# Altium schematic sheet PL_DDR.SchDoc: PL_DDR
size A2; Author: Carlos Barreiro; Organization: Escuela Técnica Superior de Ingeniería de Sistemas Informáticos de la Universidad Politécnica de Madrid; Address1: Campus Sur de la Universidad Politécnica de Madrid; Address2: Calle de Alan Turing, s/nº; Address3: Madrid 28031; Address4: España; DocumentNumber: 4; SheetNumber: 4; SheetTotal: 16
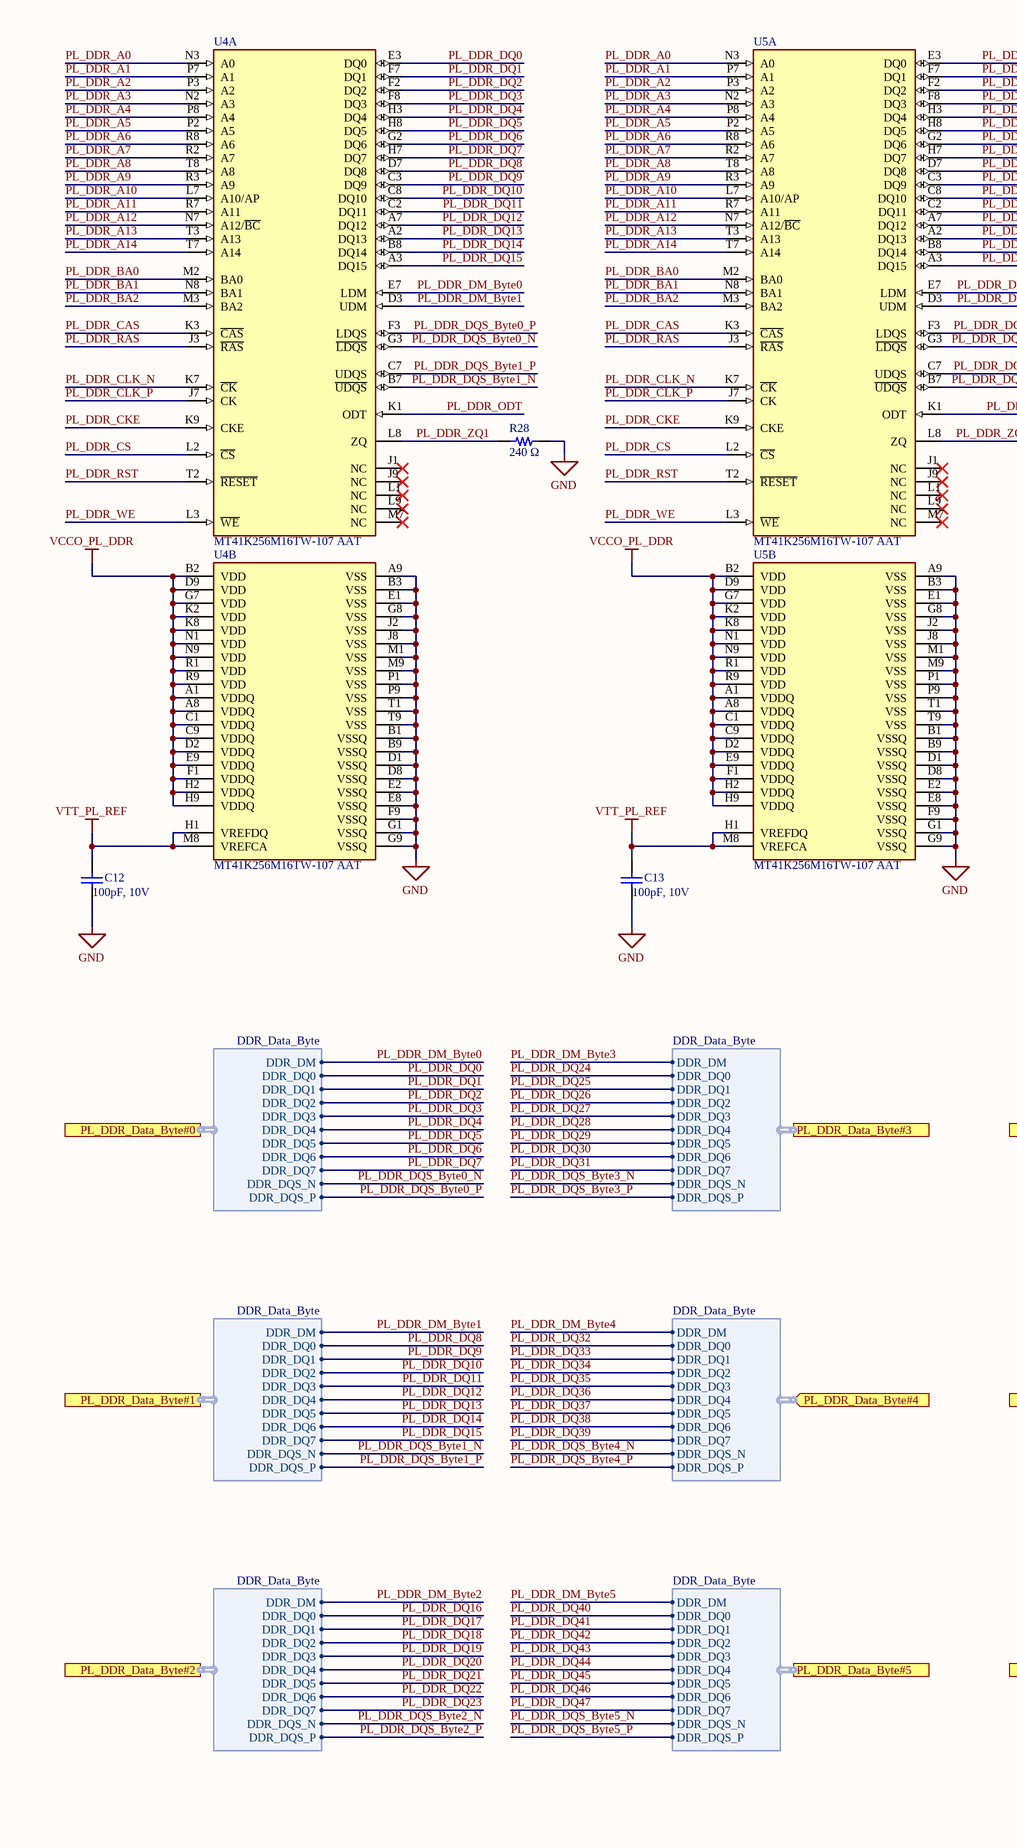
[diagram p0: PL_DDR.SchDoc, left]
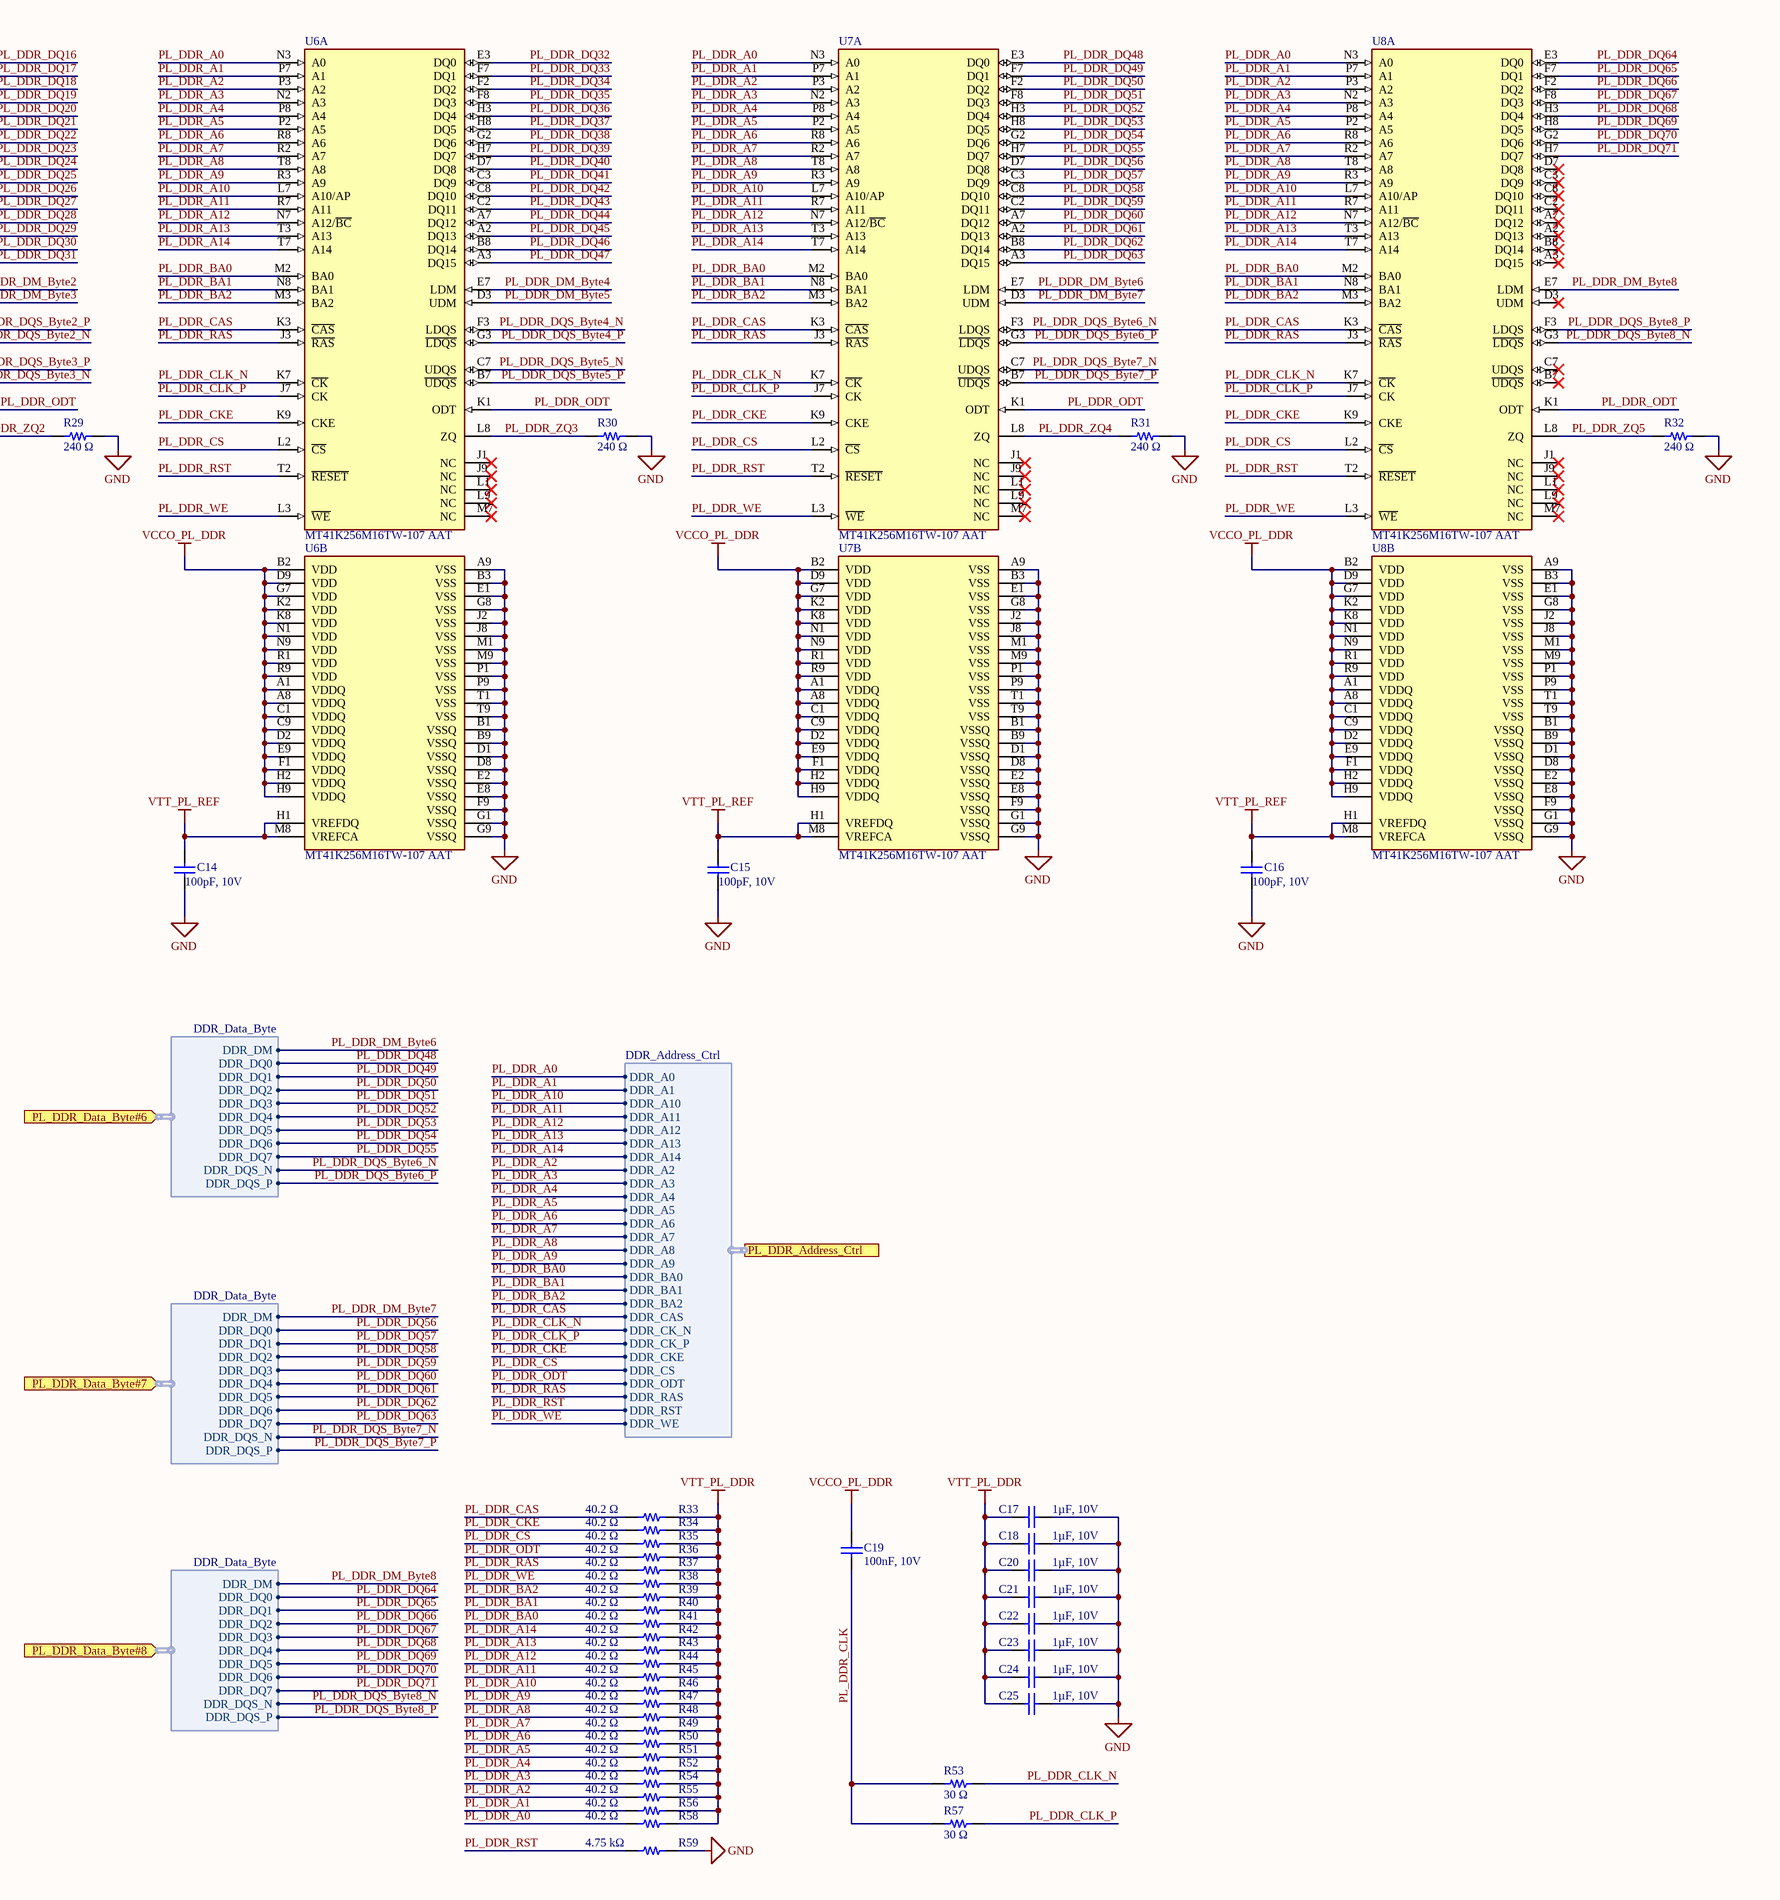
[diagram p1: PL_DDR.SchDoc, right]

## Parts
C12  100pF, 10V  [WURTH_WCAP-CSGP_0402]
C13  100pF, 10V  [WURTH_WCAP-CSGP_0402]
C14  100pF, 10V  [WURTH_WCAP-CSGP_0402]
C15  100pF, 10V  [WURTH_WCAP-CSGP_0402]
C16  100pF, 10V  [WURTH_WCAP-CSGP_0402]
C17  1µF, 10V  [WURTH_WCAP-CSGP_0402]
C18  1µF, 10V  [WURTH_WCAP-CSGP_0402]
C19  100nF, 10V  [WURTH_WCAP-CSGP_0402]
C20  1µF, 10V  [WURTH_WCAP-CSGP_0402]
C21  1µF, 10V  [WURTH_WCAP-CSGP_0402]
C22  1µF, 10V  [WURTH_WCAP-CSGP_0402]
C23  1µF, 10V  [WURTH_WCAP-CSGP_0402]
C24  1µF, 10V  [WURTH_WCAP-CSGP_0402]
C25  1µF, 10V  [WURTH_WCAP-CSGP_0402]
R28  240 Ω  [PANASONIC_ERJ2G_0402]
R29  240 Ω  [PANASONIC_ERJ2G_0402]
R30  240 Ω  [PANASONIC_ERJ2G_0402]
R31  240 Ω  [PANASONIC_ERJ2G_0402]
R32  240 Ω  [PANASONIC_ERJ2G_0402]
R33  40.2 Ω  [PANASONIC_ERJ2G_0402]
R34  40.2 Ω  [PANASONIC_ERJ2G_0402]
R35  40.2 Ω  [PANASONIC_ERJ2G_0402]
R36  40.2 Ω  [PANASONIC_ERJ2G_0402]
R37  40.2 Ω  [PANASONIC_ERJ2G_0402]
R38  40.2 Ω  [PANASONIC_ERJ2G_0402]
R39  40.2 Ω  [PANASONIC_ERJ2G_0402]
R40  40.2 Ω  [PANASONIC_ERJ2G_0402]
R41  40.2 Ω  [PANASONIC_ERJ2G_0402]
R42  40.2 Ω  [PANASONIC_ERJ2G_0402]
R43  40.2 Ω  [PANASONIC_ERJ2G_0402]
R44  40.2 Ω  [PANASONIC_ERJ2G_0402]
R45  40.2 Ω  [PANASONIC_ERJ2G_0402]
R46  40.2 Ω  [PANASONIC_ERJ2G_0402]
R47  40.2 Ω  [PANASONIC_ERJ2G_0402]
R48  40.2 Ω  [PANASONIC_ERJ2G_0402]
R49  40.2 Ω  [PANASONIC_ERJ2G_0402]
R50  40.2 Ω  [PANASONIC_ERJ2G_0402]
R51  40.2 Ω  [PANASONIC_ERJ2G_0402]
R52  40.2 Ω  [PANASONIC_ERJ2G_0402]
R53  30 Ω  [PANASONIC_ERJ2G_0402]
R54  40.2 Ω  [PANASONIC_ERJ2G_0402]
R55  40.2 Ω  [PANASONIC_ERJ2G_0402]
R56  40.2 Ω  [PANASONIC_ERJ2G_0402]
R57  30 Ω  [PANASONIC_ERJ2G_0402]
R58  40.2 Ω  [PANASONIC_ERJ2G_0402]
R59  4.75 kΩ  [PANASONIC_ERJ2G_0402]
U4  MT41K256M16TW-107 AAT  [Micron_TW]  (parts A,B of 2)
U5  MT41K256M16TW-107 AAT  [Micron_TW]  (parts A,B of 2)
U6  MT41K256M16TW-107 AAT  [Micron_TW]  (parts A,B of 2)
U7  MT41K256M16TW-107 AAT  [Micron_TW]  (parts A,B of 2)
U8  MT41K256M16TW-107 AAT  [Micron_TW]  (parts A,B of 2)

## Ports
PL_DDR_Address_Ctrl (harness DDR_Address_Ctrl), PL_DDR_Data_Byte#0 (harness DDR_Data_Byte), PL_DDR_Data_Byte#1 (harness DDR_Data_Byte), PL_DDR_Data_Byte#2 (harness DDR_Data_Byte), PL_DDR_Data_Byte#3 (harness DDR_Data_Byte), PL_DDR_Data_Byte#4 (in, harness DDR_Data_Byte), PL_DDR_Data_Byte#5 (harness DDR_Data_Byte), PL_DDR_Data_Byte#6 (in, harness DDR_Data_Byte), PL_DDR_Data_Byte#7 (in, harness DDR_Data_Byte), PL_DDR_Data_Byte#8 (in, harness DDR_Data_Byte)

## Harnesses
DDR_Data_Byte: DDR_DM, DDR_DQ0, DDR_DQ1, DDR_DQ2, DDR_DQ3, DDR_DQ4, DDR_DQ5, DDR_DQ6, DDR_DQ7, DDR_DQS_N, DDR_DQS_P
DDR_Address_Ctrl: DDR_A0, DDR_A1, DDR_A10, DDR_A11, DDR_A12, DDR_A13, DDR_A14, DDR_A2, DDR_A3, DDR_A4, DDR_A5, DDR_A6, DDR_A7, DDR_A8, DDR_A9, DDR_BA0, DDR_BA1, DDR_BA2, DDR_CAS, DDR_CK_N, DDR_CK_P, DDR_CKE, DDR_CS, DDR_ODT, DDR_RAS, DDR_RST, DDR_WE

## Nets
GND: C12.1 C13.1 C14.1 C15.1 C16.1 C17.1 C18.1 C20.1 C21.2 C22.1 C23.1 C24.1 C25.1 R28.2 R29.2 R30.2 R31.2 R32.2 R59.2 U4.A9(VSS) U4.B1(VSSQ) U4.B3(VSS) U4.B9(VSSQ) U4.D1(VSSQ) U4.D8(VSSQ) U4.E1(VSS) U4.E2(VSSQ) U4.E8(VSSQ) U4.F9(VSSQ) U4.G1(VSSQ) U4.G8(VSS) U4.G9(VSSQ) U4.J2(VSS) U4.J8(VSS) U4.M1(VSS) U4.M9(VSS) U4.P1(VSS) U4.P9(VSS) U4.T1(VSS) U4.T9(VSS) U5.A9(VSS) U5.B1(VSSQ) U5.B3(VSS) U5.B9(VSSQ) U5.D1(VSSQ) U5.D8(VSSQ) U5.E1(VSS) U5.E2(VSSQ) U5.E8(VSSQ) U5.F9(VSSQ) U5.G1(VSSQ) U5.G8(VSS) U5.G9(VSSQ) U5.J2(VSS) U5.J8(VSS) U5.M1(VSS) U5.M9(VSS) U5.P1(VSS) U5.P9(VSS) U5.T1(VSS) U5.T9(VSS) U6.A9(VSS) U6.B1(VSSQ) U6.B3(VSS) U6.B9(VSSQ) U6.D1(VSSQ) U6.D8(VSSQ) U6.E1(VSS) U6.E2(VSSQ) U6.E8(VSSQ) U6.F9(VSSQ) U6.G1(VSSQ) U6.G8(VSS) U6.G9(VSSQ) U6.J2(VSS) U6.J8(VSS) U6.M1(VSS) U6.M9(VSS) U6.P1(VSS) U6.P9(VSS) U6.T1(VSS) U6.T9(VSS) U7.A9(VSS) U7.B1(VSSQ) U7.B3(VSS) U7.B9(VSSQ) U7.D1(VSSQ) U7.D8(VSSQ) U7.E1(VSS) U7.E2(VSSQ) U7.E8(VSSQ) U7.F9(VSSQ) U7.G1(VSSQ) U7.G8(VSS) U7.G9(VSSQ) U7.J2(VSS) U7.J8(VSS) U7.M1(VSS) U7.M9(VSS) U7.P1(VSS) U7.P9(VSS) U7.T1(VSS) U7.T9(VSS) U8.A9(VSS) U8.B1(VSSQ) U8.B3(VSS) U8.B9(VSSQ) U8.D1(VSSQ) U8.D8(VSSQ) U8.E1(VSS) U8.E2(VSSQ) U8.E8(VSSQ) U8.F9(VSSQ) U8.G1(VSSQ) U8.G8(VSS) U8.G9(VSSQ) U8.J2(VSS) U8.J8(VSS) U8.M1(VSS) U8.M9(VSS) U8.P1(VSS) U8.P9(VSS) U8.T1(VSS) U8.T9(VSS)
VCCO_PL_DDR: C19.2 U4.A1(VDDQ) U4.A8(VDDQ) U4.B2(VDD) U4.C1(VDDQ) U4.C9(VDDQ) U4.D2(VDDQ) U4.D9(VDD) U4.E9(VDDQ) U4.F1(VDDQ) U4.G7(VDD) U4.H2(VDDQ) U4.H9(VDDQ) U4.K2(VDD) U4.K8(VDD) U4.N1(VDD) U4.N9(VDD) U4.R1(VDD) U4.R9(VDD) U5.A1(VDDQ) U5.A8(VDDQ) U5.B2(VDD) U5.C1(VDDQ) U5.C9(VDDQ) U5.D2(VDDQ) U5.D9(VDD) U5.E9(VDDQ) U5.F1(VDDQ) U5.G7(VDD) U5.H2(VDDQ) U5.H9(VDDQ) U5.K2(VDD) U5.K8(VDD) U5.N1(VDD) U5.N9(VDD) U5.R1(VDD) U5.R9(VDD) U6.A1(VDDQ) U6.A8(VDDQ) U6.B2(VDD) U6.C1(VDDQ) U6.C9(VDDQ) U6.D2(VDDQ) U6.D9(VDD) U6.E9(VDDQ) U6.F1(VDDQ) U6.G7(VDD) U6.H2(VDDQ) U6.H9(VDDQ) U6.K2(VDD) U6.K8(VDD) U6.N1(VDD) U6.N9(VDD) U6.R1(VDD) U6.R9(VDD) U7.A1(VDDQ) U7.A8(VDDQ) U7.B2(VDD) U7.C1(VDDQ) U7.C9(VDDQ) U7.D2(VDDQ) U7.D9(VDD) U7.E9(VDDQ) U7.F1(VDDQ) U7.G7(VDD) U7.H2(VDDQ) U7.H9(VDDQ) U7.K2(VDD) U7.K8(VDD) U7.N1(VDD) U7.N9(VDD) U7.R1(VDD) U7.R9(VDD) U8.A1(VDDQ) U8.A8(VDDQ) U8.B2(VDD) U8.C1(VDDQ) U8.C9(VDDQ) U8.D2(VDDQ) U8.D9(VDD) U8.E9(VDDQ) U8.F1(VDDQ) U8.G7(VDD) U8.H2(VDDQ) U8.H9(VDDQ) U8.K2(VDD) U8.K8(VDD) U8.N1(VDD) U8.N9(VDD) U8.R1(VDD) U8.R9(VDD)
VTT_PL_DDR: C17.2 C18.2 C20.2 C21.1 C22.2 C23.2 C24.2 C25.2 R33.2 R34.2 R35.2 R36.2 R37.2 R38.2 R39.2 R40.2 R41.2 R42.2 R43.2 R44.2 R45.2 R46.2 R47.2 R48.2 R49.2 R50.2 R51.2 R52.2 R54.2 R55.2 R56.2 R58.2
VTT_PL_REF: C12.2 C13.2 C14.2 C15.2 C16.2 U4.H1(VREFDQ) U4.M8(VREFCA) U5.H1(VREFDQ) U5.M8(VREFCA) U6.H1(VREFDQ) U6.M8(VREFCA) U7.H1(VREFDQ) U7.M8(VREFCA) U8.H1(VREFDQ) U8.M8(VREFCA)
PL_DDR_A0: R58.1 U4.N3(A0) U5.N3(A0) U6.N3(A0) U7.N3(A0) U8.N3(A0) ; port PL_DDR_Address_Ctrl.DDR_A0
PL_DDR_A1: R56.1 U4.P7(A1) U5.P7(A1) U6.P7(A1) U7.P7(A1) U8.P7(A1) ; port PL_DDR_Address_Ctrl.DDR_A1
PL_DDR_A2: R55.1 U4.P3(A2) U5.P3(A2) U6.P3(A2) U7.P3(A2) U8.P3(A2) ; port PL_DDR_Address_Ctrl.DDR_A2
PL_DDR_A3: R54.1 U4.N2(A3) U5.N2(A3) U6.N2(A3) U7.N2(A3) U8.N2(A3) ; port PL_DDR_Address_Ctrl.DDR_A3
PL_DDR_A4: R52.1 U4.P8(A4) U5.P8(A4) U6.P8(A4) U7.P8(A4) U8.P8(A4) ; port PL_DDR_Address_Ctrl.DDR_A4
PL_DDR_A5: R51.1 U4.P2(A5) U5.P2(A5) U6.P2(A5) U7.P2(A5) U8.P2(A5) ; port PL_DDR_Address_Ctrl.DDR_A5
PL_DDR_A6: R50.1 U4.R8(A6) U5.R8(A6) U6.R8(A6) U7.R8(A6) U8.R8(A6) ; port PL_DDR_Address_Ctrl.DDR_A6
PL_DDR_A7: R49.1 U4.R2(A7) U5.R2(A7) U6.R2(A7) U7.R2(A7) U8.R2(A7) ; port PL_DDR_Address_Ctrl.DDR_A7
PL_DDR_A8: R48.1 U4.T8(A8) U5.T8(A8) U6.T8(A8) U7.T8(A8) U8.T8(A8) ; port PL_DDR_Address_Ctrl.DDR_A8
PL_DDR_A9: R47.1 U4.R3(A9) U5.R3(A9) U6.R3(A9) U7.R3(A9) U8.R3(A9) ; port PL_DDR_Address_Ctrl.DDR_A9
PL_DDR_A10: R46.1 U4.L7(A10/AP) U5.L7(A10/AP) U6.L7(A10/AP) U7.L7(A10/AP) U8.L7(A10/AP) ; port PL_DDR_Address_Ctrl.DDR_A10
PL_DDR_A11: R45.1 U4.R7(A11) U5.R7(A11) U6.R7(A11) U7.R7(A11) U8.R7(A11) ; port PL_DDR_Address_Ctrl.DDR_A11
PL_DDR_A12: R44.1 U4.N7(A12/~{BC}) U5.N7(A12/~{BC}) U6.N7(A12/~{BC}) U7.N7(A12/~{BC}) U8.N7(A12/~{BC}) ; port PL_DDR_Address_Ctrl.DDR_A12
PL_DDR_A13: R43.1 U4.T3(A13) U5.T3(A13) U6.T3(A13) U7.T3(A13) U8.T3(A13) ; port PL_DDR_Address_Ctrl.DDR_A13
PL_DDR_A14: R42.1 U4.T7(A14) U5.T7(A14) U6.T7(A14) U7.T7(A14) U8.T7(A14) ; port PL_DDR_Address_Ctrl.DDR_A14
PL_DDR_BA0: R41.1 U4.M2(BA0) U5.M2(BA0) U6.M2(BA0) U7.M2(BA0) U8.M2(BA0) ; port PL_DDR_Address_Ctrl.DDR_BA0
PL_DDR_BA1: R40.1 U4.N8(BA1) U5.N8(BA1) U6.N8(BA1) U7.N8(BA1) U8.N8(BA1) ; port PL_DDR_Address_Ctrl.DDR_BA1
PL_DDR_BA2: R39.1 U4.M3(BA2) U5.M3(BA2) U6.M3(BA2) U7.M3(BA2) U8.M3(BA2) ; port PL_DDR_Address_Ctrl.DDR_BA2
PL_DDR_CAS: R33.1 U4.K3(~{CAS}) U5.K3(~{CAS}) U6.K3(~{CAS}) U7.K3(~{CAS}) U8.K3(~{CAS}) ; port PL_DDR_Address_Ctrl.DDR_CAS
PL_DDR_CKE: R34.1 U4.K9(CKE) U5.K9(CKE) U6.K9(CKE) U7.K9(CKE) U8.K9(CKE) ; port PL_DDR_Address_Ctrl.DDR_CKE
PL_DDR_CLK: C19.1 R53.2 R57.2
PL_DDR_CLK_N: R53.1 U4.K7(~{CK}) U5.K7(~{CK}) U6.K7(~{CK}) U7.K7(~{CK}) U8.K7(~{CK}) ; port PL_DDR_Address_Ctrl.DDR_CK_N
PL_DDR_CLK_P: R57.1 U4.J7(CK) U5.J7(CK) U6.J7(CK) U7.J7(CK) U8.J7(CK) ; port PL_DDR_Address_Ctrl.DDR_CK_P
PL_DDR_CS: R35.1 U4.L2(~{CS}) U5.L2(~{CS}) U6.L2(~{CS}) U7.L2(~{CS}) U8.L2(~{CS}) ; port PL_DDR_Address_Ctrl.DDR_CS
PL_DDR_DM_Byte0: U4.E7(LDM) ; port PL_DDR_Data_Byte#0.DDR_DM
PL_DDR_DM_Byte1: U4.D3(UDM) ; port PL_DDR_Data_Byte#1.DDR_DM
PL_DDR_DM_Byte2: U5.E7(LDM) ; port PL_DDR_Data_Byte#2.DDR_DM
PL_DDR_DM_Byte3: U5.D3(UDM) ; port PL_DDR_Data_Byte#3.DDR_DM
PL_DDR_DM_Byte4: U6.E7(LDM) ; port PL_DDR_Data_Byte#4.DDR_DM
PL_DDR_DM_Byte5: U6.D3(UDM) ; port PL_DDR_Data_Byte#5.DDR_DM
PL_DDR_DM_Byte6: U7.E7(LDM) ; port PL_DDR_Data_Byte#6.DDR_DM
PL_DDR_DM_Byte7: U7.D3(UDM) ; port PL_DDR_Data_Byte#7.DDR_DM
PL_DDR_DM_Byte8: U8.E7(LDM) ; port PL_DDR_Data_Byte#8.DDR_DM
PL_DDR_DQ0: U4.E3(DQ0) ; port PL_DDR_Data_Byte#0.DDR_DQ0
PL_DDR_DQ1: U4.F7(DQ1) ; port PL_DDR_Data_Byte#0.DDR_DQ1
PL_DDR_DQ2: U4.F2(DQ2) ; port PL_DDR_Data_Byte#0.DDR_DQ2
PL_DDR_DQ3: U4.F8(DQ3) ; port PL_DDR_Data_Byte#0.DDR_DQ3
PL_DDR_DQ4: U4.H3(DQ4) ; port PL_DDR_Data_Byte#0.DDR_DQ4
PL_DDR_DQ5: U4.H8(DQ5) ; port PL_DDR_Data_Byte#0.DDR_DQ5
PL_DDR_DQ6: U4.G2(DQ6) ; port PL_DDR_Data_Byte#0.DDR_DQ6
PL_DDR_DQ7: U4.H7(DQ7) ; port PL_DDR_Data_Byte#0.DDR_DQ7
PL_DDR_DQ8: U4.D7(DQ8) ; port PL_DDR_Data_Byte#1.DDR_DQ0
PL_DDR_DQ9: U4.C3(DQ9) ; port PL_DDR_Data_Byte#1.DDR_DQ1
PL_DDR_DQ10: U4.C8(DQ10) ; port PL_DDR_Data_Byte#1.DDR_DQ2
PL_DDR_DQ11: U4.C2(DQ11) ; port PL_DDR_Data_Byte#1.DDR_DQ3
PL_DDR_DQ12: U4.A7(DQ12) ; port PL_DDR_Data_Byte#1.DDR_DQ4
PL_DDR_DQ13: U4.A2(DQ13) ; port PL_DDR_Data_Byte#1.DDR_DQ5
PL_DDR_DQ14: U4.B8(DQ14) ; port PL_DDR_Data_Byte#1.DDR_DQ6
PL_DDR_DQ15: U4.A3(DQ15) ; port PL_DDR_Data_Byte#1.DDR_DQ7
PL_DDR_DQ16: U5.E3(DQ0) ; port PL_DDR_Data_Byte#2.DDR_DQ0
PL_DDR_DQ17: U5.F7(DQ1) ; port PL_DDR_Data_Byte#2.DDR_DQ1
PL_DDR_DQ18: U5.F2(DQ2) ; port PL_DDR_Data_Byte#2.DDR_DQ2
PL_DDR_DQ19: U5.F8(DQ3) ; port PL_DDR_Data_Byte#2.DDR_DQ3
PL_DDR_DQ20: U5.H3(DQ4) ; port PL_DDR_Data_Byte#2.DDR_DQ4
PL_DDR_DQ21: U5.H8(DQ5) ; port PL_DDR_Data_Byte#2.DDR_DQ5
PL_DDR_DQ22: U5.G2(DQ6) ; port PL_DDR_Data_Byte#2.DDR_DQ6
PL_DDR_DQ23: U5.H7(DQ7) ; port PL_DDR_Data_Byte#2.DDR_DQ7
PL_DDR_DQ24: U5.D7(DQ8) ; port PL_DDR_Data_Byte#3.DDR_DQ0
PL_DDR_DQ25: U5.C3(DQ9) ; port PL_DDR_Data_Byte#3.DDR_DQ1
PL_DDR_DQ26: U5.C8(DQ10) ; port PL_DDR_Data_Byte#3.DDR_DQ2
PL_DDR_DQ27: U5.C2(DQ11) ; port PL_DDR_Data_Byte#3.DDR_DQ3
PL_DDR_DQ28: U5.A7(DQ12) ; port PL_DDR_Data_Byte#3.DDR_DQ4
PL_DDR_DQ29: U5.A2(DQ13) ; port PL_DDR_Data_Byte#3.DDR_DQ5
PL_DDR_DQ30: U5.B8(DQ14) ; port PL_DDR_Data_Byte#3.DDR_DQ6
PL_DDR_DQ31: U5.A3(DQ15) ; port PL_DDR_Data_Byte#3.DDR_DQ7
PL_DDR_DQ32: U6.E3(DQ0) ; port PL_DDR_Data_Byte#4.DDR_DQ0
PL_DDR_DQ33: U6.F7(DQ1) ; port PL_DDR_Data_Byte#4.DDR_DQ1
PL_DDR_DQ34: U6.F2(DQ2) ; port PL_DDR_Data_Byte#4.DDR_DQ2
PL_DDR_DQ35: U6.F8(DQ3) ; port PL_DDR_Data_Byte#4.DDR_DQ3
PL_DDR_DQ36: U6.H3(DQ4) ; port PL_DDR_Data_Byte#4.DDR_DQ4
PL_DDR_DQ37: U6.H8(DQ5) ; port PL_DDR_Data_Byte#4.DDR_DQ5
PL_DDR_DQ38: U6.G2(DQ6) ; port PL_DDR_Data_Byte#4.DDR_DQ6
PL_DDR_DQ39: U6.H7(DQ7) ; port PL_DDR_Data_Byte#4.DDR_DQ7
PL_DDR_DQ40: U6.D7(DQ8) ; port PL_DDR_Data_Byte#5.DDR_DQ0
PL_DDR_DQ41: U6.C3(DQ9) ; port PL_DDR_Data_Byte#5.DDR_DQ1
PL_DDR_DQ42: U6.C8(DQ10) ; port PL_DDR_Data_Byte#5.DDR_DQ2
PL_DDR_DQ43: U6.C2(DQ11) ; port PL_DDR_Data_Byte#5.DDR_DQ3
PL_DDR_DQ44: U6.A7(DQ12) ; port PL_DDR_Data_Byte#5.DDR_DQ4
PL_DDR_DQ45: U6.A2(DQ13) ; port PL_DDR_Data_Byte#5.DDR_DQ5
PL_DDR_DQ46: U6.B8(DQ14) ; port PL_DDR_Data_Byte#5.DDR_DQ6
PL_DDR_DQ47: U6.A3(DQ15) ; port PL_DDR_Data_Byte#5.DDR_DQ7
PL_DDR_DQ48: U7.E3(DQ0) ; port PL_DDR_Data_Byte#6.DDR_DQ0
PL_DDR_DQ49: U7.F7(DQ1) ; port PL_DDR_Data_Byte#6.DDR_DQ1
PL_DDR_DQ50: U7.F2(DQ2) ; port PL_DDR_Data_Byte#6.DDR_DQ2
PL_DDR_DQ51: U7.F8(DQ3) ; port PL_DDR_Data_Byte#6.DDR_DQ3
PL_DDR_DQ52: U7.H3(DQ4) ; port PL_DDR_Data_Byte#6.DDR_DQ4
PL_DDR_DQ53: U7.H8(DQ5) ; port PL_DDR_Data_Byte#6.DDR_DQ5
PL_DDR_DQ54: U7.G2(DQ6) ; port PL_DDR_Data_Byte#6.DDR_DQ6
PL_DDR_DQ55: U7.H7(DQ7) ; port PL_DDR_Data_Byte#6.DDR_DQ7
PL_DDR_DQ56: U7.D7(DQ8) ; port PL_DDR_Data_Byte#7.DDR_DQ0
PL_DDR_DQ57: U7.C3(DQ9) ; port PL_DDR_Data_Byte#7.DDR_DQ1
PL_DDR_DQ58: U7.C8(DQ10) ; port PL_DDR_Data_Byte#7.DDR_DQ2
PL_DDR_DQ59: U7.C2(DQ11) ; port PL_DDR_Data_Byte#7.DDR_DQ3
PL_DDR_DQ60: U7.A7(DQ12) ; port PL_DDR_Data_Byte#7.DDR_DQ4
PL_DDR_DQ61: U7.A2(DQ13) ; port PL_DDR_Data_Byte#7.DDR_DQ5
PL_DDR_DQ62: U7.B8(DQ14) ; port PL_DDR_Data_Byte#7.DDR_DQ6
PL_DDR_DQ63: U7.A3(DQ15) ; port PL_DDR_Data_Byte#7.DDR_DQ7
PL_DDR_DQ64: U8.E3(DQ0) ; port PL_DDR_Data_Byte#8.DDR_DQ0
PL_DDR_DQ65: U8.F7(DQ1) ; port PL_DDR_Data_Byte#8.DDR_DQ1
PL_DDR_DQ66: U8.F2(DQ2) ; port PL_DDR_Data_Byte#8.DDR_DQ2
PL_DDR_DQ67: U8.F8(DQ3) ; port PL_DDR_Data_Byte#8.DDR_DQ3
PL_DDR_DQ68: U8.H3(DQ4) ; port PL_DDR_Data_Byte#8.DDR_DQ4
PL_DDR_DQ69: U8.H8(DQ5) ; port PL_DDR_Data_Byte#8.DDR_DQ5
PL_DDR_DQ70: U8.G2(DQ6) ; port PL_DDR_Data_Byte#8.DDR_DQ6
PL_DDR_DQ71: U8.H7(DQ7) ; port PL_DDR_Data_Byte#8.DDR_DQ7
PL_DDR_DQS_Byte0_N: U4.G3(~{LDQS}) ; port PL_DDR_Data_Byte#0.DDR_DQS_N
PL_DDR_DQS_Byte0_P: U4.F3(LDQS) ; port PL_DDR_Data_Byte#0.DDR_DQS_P
PL_DDR_DQS_Byte1_N: U4.B7(~{UDQS}) ; port PL_DDR_Data_Byte#1.DDR_DQS_N
PL_DDR_DQS_Byte1_P: U4.C7(UDQS) ; port PL_DDR_Data_Byte#1.DDR_DQS_P
PL_DDR_DQS_Byte2_N: U5.G3(~{LDQS}) ; port PL_DDR_Data_Byte#2.DDR_DQS_N
PL_DDR_DQS_Byte2_P: U5.F3(LDQS) ; port PL_DDR_Data_Byte#2.DDR_DQS_P
PL_DDR_DQS_Byte3_N: U5.B7(~{UDQS}) ; port PL_DDR_Data_Byte#3.DDR_DQS_N
PL_DDR_DQS_Byte3_P: U5.C7(UDQS) ; port PL_DDR_Data_Byte#3.DDR_DQS_P
PL_DDR_DQS_Byte4_N: U6.F3(LDQS) ; port PL_DDR_Data_Byte#4.DDR_DQS_N
PL_DDR_DQS_Byte4_P: U6.G3(~{LDQS}) ; port PL_DDR_Data_Byte#4.DDR_DQS_P
PL_DDR_DQS_Byte5_N: U6.C7(UDQS) ; port PL_DDR_Data_Byte#5.DDR_DQS_N
PL_DDR_DQS_Byte5_P: U6.B7(~{UDQS}) ; port PL_DDR_Data_Byte#5.DDR_DQS_P
PL_DDR_DQS_Byte6_N: U7.F3(LDQS) ; port PL_DDR_Data_Byte#6.DDR_DQS_N
PL_DDR_DQS_Byte6_P: U7.G3(~{LDQS}) ; port PL_DDR_Data_Byte#6.DDR_DQS_P
PL_DDR_DQS_Byte7_N: U7.C7(UDQS) ; port PL_DDR_Data_Byte#7.DDR_DQS_N
PL_DDR_DQS_Byte7_P: U7.B7(~{UDQS}) ; port PL_DDR_Data_Byte#7.DDR_DQS_P
PL_DDR_DQS_Byte8_N: U8.G3(~{LDQS}) ; port PL_DDR_Data_Byte#8.DDR_DQS_N
PL_DDR_DQS_Byte8_P: U8.F3(LDQS) ; port PL_DDR_Data_Byte#8.DDR_DQS_P
PL_DDR_ODT: R36.1 U4.K1(ODT) U5.K1(ODT) U6.K1(ODT) U7.K1(ODT) U8.K1(ODT) ; port PL_DDR_Address_Ctrl.DDR_ODT
PL_DDR_RAS: R37.1 U4.J3(~{RAS}) U5.J3(~{RAS}) U6.J3(~{RAS}) U7.J3(~{RAS}) U8.J3(~{RAS}) ; port PL_DDR_Address_Ctrl.DDR_RAS
PL_DDR_RST: R59.1 U4.T2(~{RESET}) U5.T2(~{RESET}) U6.T2(~{RESET}) U7.T2(~{RESET}) U8.T2(~{RESET}) ; port PL_DDR_Address_Ctrl.DDR_RST
PL_DDR_WE: R38.1 U4.L3(~{WE}) U5.L3(~{WE}) U6.L3(~{WE}) U7.L3(~{WE}) U8.L3(~{WE}) ; port PL_DDR_Address_Ctrl.DDR_WE
PL_DDR_ZQ1: R28.1 U4.L8(ZQ)
PL_DDR_ZQ2: R29.1 U5.L8(ZQ)
PL_DDR_ZQ3: R30.1 U6.L8(ZQ)
PL_DDR_ZQ4: R31.1 U7.L8(ZQ)
PL_DDR_ZQ5: R32.1 U8.L8(ZQ)

Not connected (* = marked no-connect by the designer): U4 J1(NC)* J9(NC)* L1(NC)* L9(NC)* M7(NC)*; U5 J1(NC)* J9(NC)* L1(NC)* L9(NC)* M7(NC)*; U6 J1(NC)* J9(NC)* L1(NC)* L9(NC)* M7(NC)*; U7 J1(NC)* J9(NC)* L1(NC)* L9(NC)* M7(NC)*; U8 A2(DQ13)* A3(DQ15)* A7(DQ12)* B7(~{UDQS})* B8(DQ14)* C2(DQ11)* C3(DQ9)* C7(UDQS)* C8(DQ10)* D3(UDM)* D7(DQ8)* J1(NC)* J9(NC)* L1(NC)* L9(NC)* M7(NC)*

## Notes on the sheet
- Title
- Size:
- Date:
- File:
- A2
- Number:
- Time:
- Revision:
- Sheet
- of

## Library data of the parts
C12-C16 = 885012005013: WCAP-CSGP Multilayer Ceramic Chip Capacitor, General Purpose, size 0402, NP0, 100pF, 10V; Manufacturer: Wurth Elektronik; Rated Voltage: 10VDC; Isolation Resistance  min.: 10GOhm; Capacitance Tolerance: +/-5%; Technical Reference: NP00402101J010DFCT10000; Q-Factor min.: 1000; ComponentLink1Description: Manufacturer; ComponentLink1URL: http://www.we-online.de; ComponentLink2Description: Datasheet; ComponentLink2URL: https://www.we-online.com/catalog/datasheet/885012005013.pdf; Operating Temperature: -55 to +125degC; Packaging: Tape and Reel; Manufacturer Part Number: 885012005013; Published Date: April 2021; Ceramic Type: NP0; Dissipation Factor max.: -; Height: 0.5mm; Mounting Technology: SMT; Size: 0402; Capacitance: 100pF
C17 C18 C20-C25 = 885012105012: WCAP-CSGP Multilayer Ceramic Chip Capacitor, General Purpose, size 0402, X5R, 1uF, 10V; Manufacturer: Wurth Elektronik; Rated Voltage: 10VDC; Isolation Resistance  min.: 0.05GOhm; Capacitance Tolerance: +/-20%; Dissipation Factor max.: 15%; Technical Reference: X5R0402105M010DFCT10000; ComponentLink1Description: Manufacturer; ComponentLink1URL: http://www.we-online.de; ComponentLink2Description: Datasheet; ComponentLink2URL: https://www.we-online.com/catalog/datasheet/885012105012.pdf; Operating Temperature: -55 to +85degC; Packaging: Tape and Reel; Manufacturer Part Number: 885012105012; Published Date: April 2021; Ceramic Type: X5R; Height: 0.5mm; Mounting Technology: SMT; Size: 0402; Capacitance: 1uF; Q-Factor min.: -; Supplier 1: Digi-Key; Supplier 2: Mouser; Supplier Part Number 2: 710-885012105012; Supplier Part Number 1: 732-7489-1-ND
C19 = 885012205018: WCAP-CSGP Multilayer Ceramic Chip Capacitor, General Purpose, size 0402, X7R, 100nF, 10V; Manufacturer: Wurth Elektronik; Rated Voltage: 10VDC; Isolation Resistance  min.: 5GOhm; Capacitance Tolerance: +/-10%; Dissipation Factor max.: 5%; Technical Reference: X7R0402104K010DFCT10000; ComponentLink1Description: Manufacturer; ComponentLink1URL: http://www.we-online.de; ComponentLink2Description: Datasheet; ComponentLink2URL: https://www.we-online.com/catalog/datasheet/885012205018.pdf; Operating Temperature: -55 to +125degC; Packaging: Tape and Reel; Manufacturer Part Number: 885012205018; Published Date: April 2021; Ceramic Type: X7R; Height: 0.5mm; Mounting Technology: SMT; Size: 0402; Capacitance: 100nF; Q-Factor min.: -
R28-R32 = ERJ2GEJ241X: General Purpose Thick Film Chip Resistors; Manufacturer: Panasonic; Power (0402): 0.1 W; Limiting Voltage (0402): 50; Maximum Voltage (0402): 100; Resistance Range (Ω): 1Ω to 100MΩ; AEC 200: Grade 0; Size (0402): 2GE; ComponentLink1Description: Catalog; ComponentLink1URL: https://industrial.panasonic.com/ww/products/pt/general-purpose-chip-resistors/models?op=search&model_status_current=1&page=0#model-list-search-results; Series: ERJ; Temperature Range (ºC): -55 to +155; Supplier 1: Newark; Supplier 2: Mouser; Supplier Part Number 1: 85Y7936; Supplier Part Number 2: 667-ERJ-2GEJ241X
R33-R52 R54-R56 R58 = ERJ2RKF40R2X: General Purpose Thick Film Chip Resistors; Manufacturer: Panasonic; Power (0402): 0.1 W; Limiting Voltage (0402): 50; Maximum Voltage (0402): 100; Resistance Range (Ω): 1Ω to 100MΩ; AEC 200: Grade 0; Size (0402): 2GE; ComponentLink1Description: Catalog; ComponentLink1URL: https://industrial.panasonic.com/ww/products/pt/general-purpose-chip-resistors/models?op=search&model_status_current=1&page=0#model-list-search-results; Series: ERJ; Temperature Range (ºC): -55 to +155; Supplier 1: Newark; Supplier 2: Digi-Key; Supplier Part Number 1: 27AC5044; Supplier Part Number 2: P40.2LCT-ND
R53 R57 = ERJ2GEJ300X: General Purpose Thick Film Chip Resistors; Manufacturer: Panasonic; Power (0402): 0.1 W; Limiting Voltage (0402): 50; Maximum Voltage (0402): 100; Resistance Range (Ω): 1Ω to 100MΩ; AEC 200: Grade 0; Size (0402): 2GE; ComponentLink1Description: Catalog; ComponentLink1URL: https://industrial.panasonic.com/ww/products/pt/general-purpose-chip-resistors/models?op=search&model_status_current=1&page=0#model-list-search-results; Series: ERJ; Temperature Range (ºC): -55 to +155; Supplier 1: Digi-Key; Supplier 2: Mouser; Supplier Part Number 1: P30JCT-ND; Supplier Part Number 2: 667-ERJ-2GEJ300X
R59 = ERJ2RKF4751X: General Purpose Thick Film Chip Resistors; Manufacturer: Panasonic; Power (0402): 0.1 W; Limiting Voltage (0402): 50; Maximum Voltage (0402): 100; Resistance Range (Ω): 1Ω to 100MΩ; AEC 200: Grade 0; Size (0402): 2GE; ComponentLink1Description: Catalog; ComponentLink1URL: https://industrial.panasonic.com/ww/products/pt/general-purpose-chip-resistors/models?op=search&model_status_current=1&page=0#model-list-search-results; Series: ERJ; Temperature Range (ºC): -55 to +155; Supplier 1: RSComponents; Supplier 2: Digi-Key; Supplier Part Number 1: 1065277; Supplier Part Number 2: P4.75KLCT-ND
U4-U8 = MT41K256M16TW-107 AAT: DDR3L SDRAM; Data Rate: DDR3-1866; Density: 4Gb; FBGA Code: D9SHM; Nominal Supply Voltage (DC): 1.35 V; Supplier 1: Digi-Key; Supplier 2: Mouser; Supplier Part Number 1: MT41K256M16TW-107IT:P-ND; Supplier Part Number 2: 340-265862-TRAY; Operating Temperature: -40ºC to +105ºC; Width: x16; Part Status: Production; Depth: 256 Meg; ComponentLink1Description: Manufacturer URL; ComponentLink1URL: http://www.micron.com/